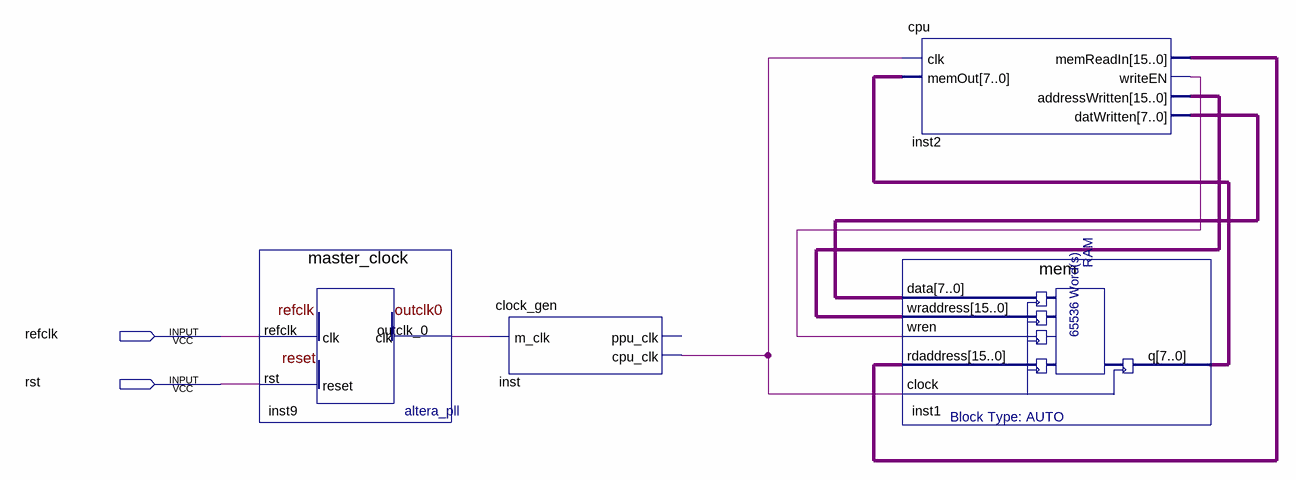
[diagram p0: schematic sheet]
// Quartus schematic FPGA_nes.bdf as structural Verilog: 4 symbols, 2 pins
module FPGA_nes (
  input  refclk,
  input  rst
);

  wire inst2_writeen, inst9_outclk_0, inst_cpu_clk;
  wire [7:0] inst1_q, inst2_datwritten;
  wire [15:0] inst2_addresswritten, inst2_memreadin;

  master_clock inst9 (.refclk(refclk), .rst(rst), .outclk_0(inst9_outclk_0));
  clock_gen inst (.m_clk(inst9_outclk_0), .cpu_clk(inst_cpu_clk));  // open: ppu_clk
  cpu inst2 (
    .clk(inst_cpu_clk), .memOut(inst1_q), .memReadIn(inst2_memreadin), .writeEN(inst2_writeen),
    .addressWritten(inst2_addresswritten), .datWritten(inst2_datwritten));
  mem inst1 (
    .data(inst2_datwritten), .wraddress(inst2_addresswritten), .wren(inst2_writeen),
    .rdaddress(inst2_memreadin), .clock(inst_cpu_clk), .q(inst1_q));
endmodule
